# EAGLE schematic v1 (EAGLE 9.2.2)
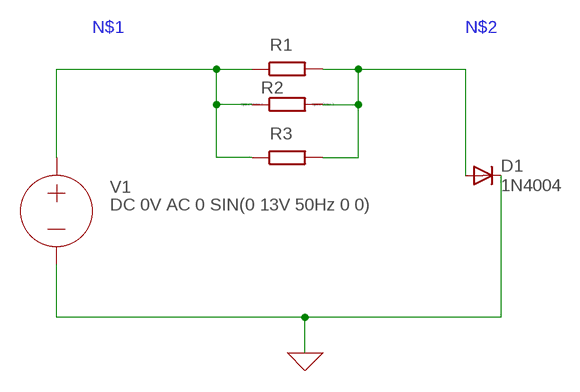
[diagram p0: schematic, sheet 1]

## Parts
D1  1N4004  [DO41-10]
R1  R  (no package)
R2  R0204/7  [0204/7]
R3  R  (no package)
V1  DC 0V AC 0 SIN(0 13V 50Hz 0 0)  VOLTAGE  (no package)

## Nets
0: D1.C V1.- ; supply symbol labelled GND
N$1: R1.1 R2.1 R3.1 V1.+
N$2: D1.A R1.2 R2.2 R3.2

## Library data of the parts
D1 = adafruit:1N4004: DIODE General purpose 1N400x type rectifier (With bigger pads) http://www.ladyada.net/library/pcb/eaglelibrary.html; SPICEMODEL: 1N4007; SPICEPREFIX: D
R1 = ngspice-simulation:R: RESISTOR; SPICEPREFIX: R
R2 = eagle-ltspice:R: RESISTOR, European symbol; SPICEMODEL: NONE; SPICEPREFIX: R
R3 = ngspice-simulation:R: RESISTOR
V1 = ngspice-simulation:VOLTAGE: Independent Voltage Source, either DC, AC, PULSE, SINE, PWL, EXP, or SFFM; VALUE: 0V